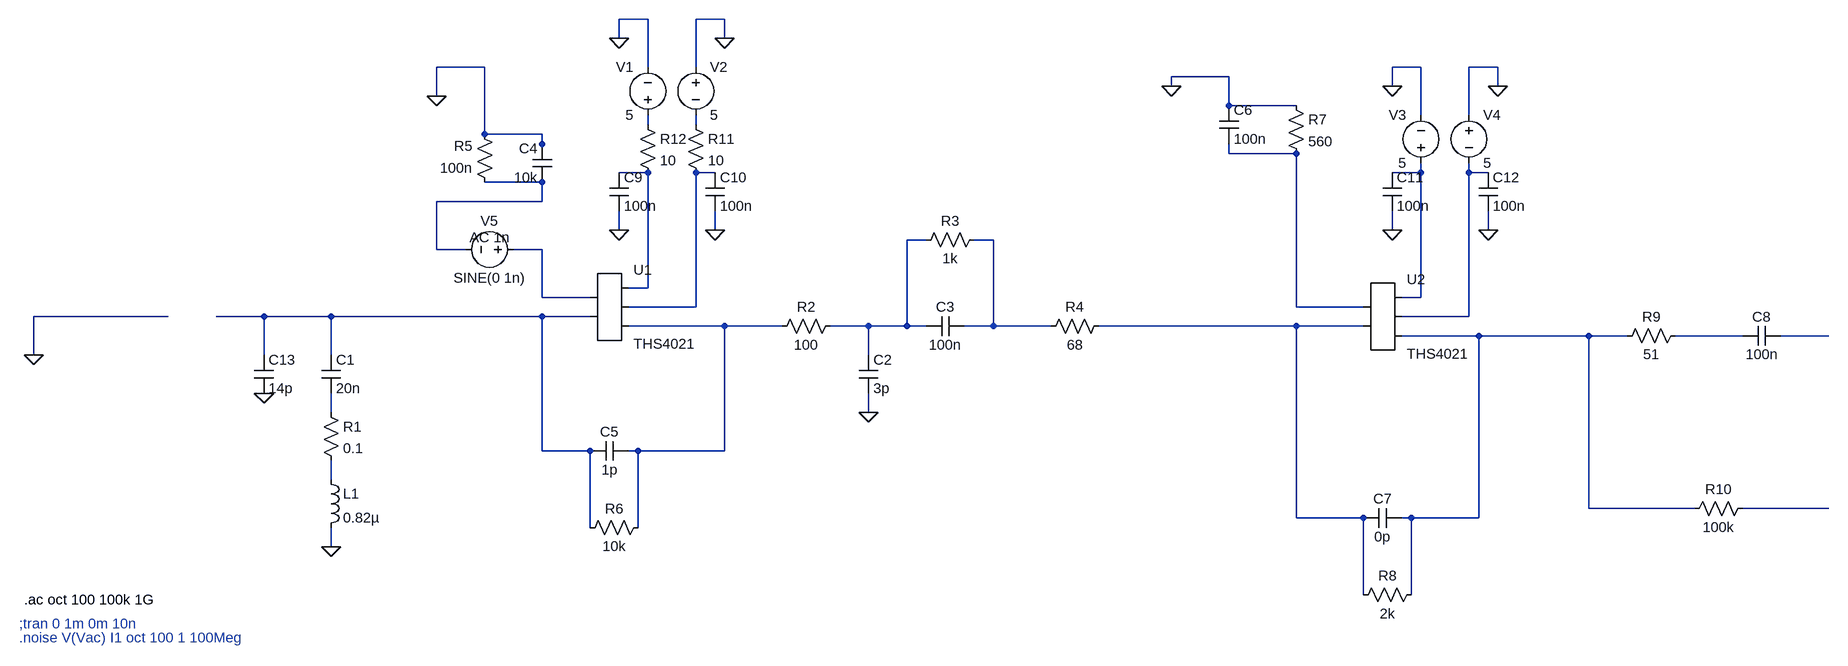
[diagram p0: schematic FastDiffAmp.asc]
FastDiffAmp.asc, the LTspice schematic file:
Version 4
SHEET 1 3020 680
WIRE 656 -416 608 -416
WIRE 784 -416 736 -416
WIRE 608 -384 608 -416
WIRE 784 -384 784 -416
WIRE 384 -336 304 -336
WIRE 656 -336 656 -416
WIRE 736 -336 736 -416
WIRE 2160 -336 2112 -336
WIRE 2288 -336 2240 -336
WIRE 1840 -320 1744 -320
WIRE 1744 -304 1744 -320
WIRE 2112 -304 2112 -336
WIRE 2288 -304 2288 -336
WIRE 304 -288 304 -336
WIRE 1840 -272 1840 -320
WIRE 1952 -272 1840 -272
WIRE 2160 -256 2160 -336
WIRE 2240 -256 2240 -336
WIRE 656 -240 656 -256
WIRE 736 -240 736 -256
WIRE 384 -224 384 -336
WIRE 480 -224 384 -224
WIRE 480 -208 480 -224
WIRE 480 -192 480 -208
WIRE 1840 -192 1840 -208
WIRE 1952 -192 1840 -192
WIRE 656 -160 608 -160
WIRE 768 -160 736 -160
WIRE 2160 -160 2160 -176
WIRE 2160 -160 2112 -160
WIRE 2240 -160 2240 -176
WIRE 2272 -160 2240 -160
WIRE 480 -144 480 -160
WIRE 480 -144 384 -144
WIRE 480 -112 480 -144
WIRE 480 -112 304 -112
WIRE 608 -64 608 -96
WIRE 768 -64 768 -96
WIRE 2112 -64 2112 -96
WIRE 2272 -64 2272 -96
WIRE 1120 -48 1088 -48
WIRE 1232 -48 1200 -48
WIRE 304 -32 304 -112
WIRE 352 -32 304 -32
WIRE 480 -32 432 -32
WIRE 656 32 656 -160
WIRE 656 32 624 32
WIRE 480 48 480 -32
WIRE 560 48 480 48
WIRE 2160 48 2160 -160
WIRE 2160 48 2128 48
WIRE 736 64 736 -160
WIRE 736 64 624 64
WIRE 1952 64 1952 -192
WIRE 2064 64 1952 64
WIRE -144 80 -368 80
WIRE 16 80 -64 80
WIRE 128 80 16 80
WIRE 480 80 128 80
WIRE 560 80 480 80
WIRE 2240 80 2240 -160
WIRE 2240 80 2128 80
WIRE 784 96 624 96
WIRE 880 96 784 96
WIRE 1024 96 960 96
WIRE 1088 96 1088 -48
WIRE 1088 96 1024 96
WIRE 1120 96 1088 96
WIRE 1232 96 1232 -48
WIRE 1232 96 1184 96
WIRE 1328 96 1232 96
WIRE 1952 96 1408 96
WIRE 2064 96 1952 96
WIRE 2256 112 2128 112
WIRE 2560 112 2256 112
WIRE 2624 112 2560 112
WIRE 2816 112 2704 112
WIRE 2960 112 2880 112
WIRE -368 144 -368 80
WIRE 16 144 16 80
WIRE 128 144 128 80
WIRE 1024 144 1024 96
WIRE 128 240 128 208
WIRE 1024 240 1024 208
WIRE 480 304 480 80
WIRE 560 304 480 304
WIRE 640 304 624 304
WIRE 784 304 784 96
WIRE 784 304 640 304
WIRE 128 352 128 320
WIRE 2560 400 2560 112
WIRE 2736 400 2560 400
WIRE 2960 400 2816 400
WIRE 1952 416 1952 96
WIRE 2064 416 1952 416
WIRE 2144 416 2128 416
WIRE 2256 416 2256 112
WIRE 2256 416 2144 416
WIRE 560 432 560 304
WIRE 640 432 640 304
WIRE 128 464 128 432
WIRE 2064 544 2064 416
WIRE 2144 544 2144 416
FLAG 128 464 0
FLAG 1024 240 0
FLAG 304 -288 0
FLAG 1744 -304 0
FLAG 608 -64 0
FLAG 768 -64 0
FLAG 784 -384 0
FLAG 608 -384 0
FLAG 2112 -64 0
FLAG 2272 -64 0
FLAG 2288 -304 0
FLAG 2112 -304 0
FLAG -368 144 0
FLAG 16 208 0
SYMBOL cap 112 144 R0
SYMATTR InstName C1
SYMATTR Value 20n
SYMBOL res 112 224 R0
SYMATTR InstName R1
SYMATTR Value 0.1
SYMBOL ind 112 336 R0
SYMATTR InstName L1
SYMATTR Value 0.82µ
SYMBOL AutoGenerated\\THS4021 592 64 R0
SYMATTR InstName U1
SYMBOL AutoGenerated\\THS4021 2096 80 R0
SYMATTR InstName U2
SYMBOL res 976 80 R90
WINDOW 0 0 56 VBottom 2
WINDOW 3 32 56 VTop 2
SYMATTR InstName R2
SYMATTR Value 100
SYMBOL cap 1008 144 R0
SYMATTR InstName C2
SYMATTR Value 3p
SYMBOL cap 1184 80 R90
WINDOW 0 0 32 VBottom 2
WINDOW 3 32 32 VTop 2
SYMATTR InstName C3
SYMATTR Value 100n
SYMBOL res 1216 -64 R90
WINDOW 0 0 56 VBottom 2
WINDOW 3 32 56 VTop 2
SYMATTR InstName R3
SYMATTR Value 1k
SYMBOL res 1424 80 R90
WINDOW 0 0 56 VBottom 2
WINDOW 3 32 56 VTop 2
SYMATTR InstName R4
SYMATTR Value 68
SYMBOL cap 496 -144 R180
WINDOW 0 24 56 Left 2
WINDOW 3 24 8 Left 2
SYMATTR InstName C4
SYMATTR Value 10k
SYMBOL res 400 -128 R180
WINDOW 0 36 76 Left 2
WINDOW 3 36 40 Left 2
SYMATTR InstName R5
SYMATTR Value 100n
SYMBOL res 656 416 R90
WINDOW 0 0 56 VBottom 2
WINDOW 3 32 56 VTop 2
SYMATTR InstName R6
SYMATTR Value 10k
SYMBOL cap 624 288 R90
WINDOW 0 0 32 VBottom 2
WINDOW 3 32 32 VTop 2
SYMATTR InstName C5
SYMATTR Value 1p
SYMBOL cap 1824 -272 R0
SYMATTR InstName C6
SYMATTR Value 100n
SYMBOL res 1936 -288 R0
SYMATTR InstName R7
SYMATTR Value 560
SYMBOL res 2160 528 R90
WINDOW 0 0 56 VBottom 2
WINDOW 3 32 56 VTop 2
SYMATTR InstName R8
SYMATTR Value 2k
SYMBOL cap 2128 400 R90
WINDOW 0 0 32 VBottom 2
WINDOW 3 32 32 VTop 2
SYMATTR InstName C7
SYMATTR Value 0p
SYMBOL res 2720 96 R90
WINDOW 0 0 56 VBottom 2
WINDOW 3 32 56 VTop 2
SYMATTR InstName R9
SYMATTR Value 51
SYMBOL cap 2880 96 R90
WINDOW 0 0 32 VBottom 2
WINDOW 3 32 32 VTop 2
SYMATTR InstName C8
SYMATTR Value 100n
SYMBOL res 2832 384 R90
WINDOW 0 0 56 VBottom 2
WINDOW 3 32 56 VTop 2
SYMATTR InstName R10
SYMATTR Value 100k
SYMBOL cap 592 -160 R0
SYMATTR InstName C9
SYMATTR Value 100n
SYMBOL cap 752 -160 R0
SYMATTR InstName C10
SYMATTR Value 100n
SYMBOL res 720 -256 R0
SYMATTR InstName R11
SYMATTR Value 10
SYMBOL res 640 -256 R0
SYMATTR InstName R12
SYMATTR Value 10
SYMBOL voltage 656 -240 R180
WINDOW 0 24 96 Left 2
WINDOW 3 24 16 Left 2
SYMATTR InstName V1
SYMATTR Value 5
SYMBOL voltage 736 -352 R0
SYMATTR InstName V2
SYMATTR Value 5
SYMBOL cap 2096 -160 R0
SYMATTR InstName C11
SYMATTR Value 100n
SYMBOL cap 2256 -160 R0
SYMATTR InstName C12
SYMATTR Value 100n
SYMBOL voltage 2160 -160 R180
WINDOW 0 24 96 Left 2
WINDOW 3 24 16 Left 2
SYMATTR InstName V3
SYMATTR Value 5
SYMBOL voltage 2240 -272 R0
SYMATTR InstName V4
SYMATTR Value 5
SYMBOL cap 0 144 R0
SYMATTR InstName C13
SYMATTR Value 14p
SYMBOL voltage 448 -32 R90
WINDOW 0 -32 56 VBottom 2
WINDOW 3 32 56 VTop 2
WINDOW 123 -4 56 VBottom 2
WINDOW 39 0 0 Left 0
SYMATTR InstName V5
SYMATTR Value SINE(0 1n)
SYMATTR Value2 AC 1n
TEXT -384 552 Left 2 !.ac oct 100 100k 1G
TEXT -392 592 Left 2 ;;tran 0 1m 0m 10n
TEXT -392 616 Left 2 ;.noise V(Vac) I1 oct 100 1 100Meg

The netlist it stands for:
* FastDiffAmp.asc
C1 N012 N018 20n
R1 N018 N019 0.1
L1 N019 0 0.82µ
* U1: THS4021 (symbol AutoGenerated\THS4021 not available, pins judged from their places): pin1=N011 pin2=N012 pin3=N004 pin4=N005 pin5=N013
* U2: THS4021 (symbol AutoGenerated\THS4021 not available, pins judged from their places): pin1=N003 pin2=N014 pin3=N006 pin4=N007 pin5=N015
R2 N009 N013 100
C2 N009 0 3p
C3 N010 N009 100n
R3 N010 N009 1k
R4 N014 N010 68
C4 N008 0 10k
R5 N008 0 100n
R6 N013 N012 10k
C5 N013 N012 1p
C6 0 N003 100n
R7 0 N003 560
R8 N015 N014 2k
C7 N015 N014 0p
R9 N016 N015 51
C8 N017 N016 100n
R10 N020 N015 100k
C9 N004 0 100n
C10 N005 0 100n
R11 N002 N005 10
R12 N001 N004 10
V1 N001 0 5
V2 0 N002 5
C11 N006 0 100n
C12 N007 0 100n
V3 N006 0 5
V4 0 N007 5
C13 N012 0 14p
V5 N011 N008 SINE(0 1n) AC 1n
.ac oct 100 100k 1G
* ;tran 0 1m 0m 10n
* .noise V(Vac) I1 oct 100 1 100Meg
.backanno
.end